# Altium schematic sheet 05_Power.SchDoc: Power
size A4; SheetNumber: 6; SheetTotal: 7; Project_Name: Monitoring_Control_Circuit; Designer: Hao Thai; Version: 1.0
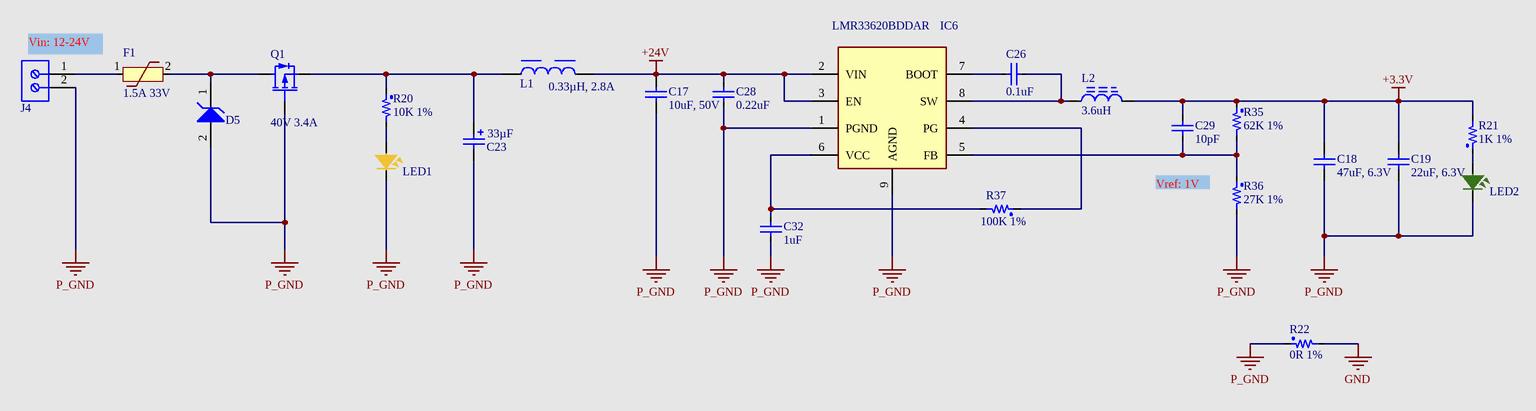
[diagram p0: 05_Power.SchDoc]

## Parts
C17  10uF, 50V  [WCAP-CSGP_1210_H=2.5mm]
C18  47uF, 6.3V  [WCAP-CSGP_1206_H=1.6mm]
C19  22uF, 6.3V  [WCAP-CSGP_1206_H=1.6mm]
C23  33µF  [WCAP-PSLP_D5H5.8]
C26  0.1uF  [C0603 (1608 metric)]
C28  0.22uF  [C0805 (2012 METRIC)]
C29  10pF  [C0603 (1608 metric)]
C32  1uF  [C0603 (1608 metric)]
D5  400W, 26VDC  [WE-TVSP_DO-214AC_Unidirectional]  (value not drawn)
F1  1.5A 33V  [FUSE_2902(7555 metric)]
IC6  LMR33620BDDAR  [SOIC127P600X170-9N]
J4  691103110002  [691103110002]  (value not drawn)
L1  0.33µH, 2.8A  [WE-TPC_2811]
L2  3.6uH  [SRN80408R2Y]
LED1  Yellow  [LED0603_YELLOW]  (value not drawn)
LED2  Green  [LED0603_GREEN]  (value not drawn)
Q1  40V 3.4A  [FET_SOT23-3]
R20  10K 1%  [R0603 (1608 Metric)]
R21  1K 1%  [R0603 (1608 Metric)]
R22  0R 1%  [R0603 (1608 Metric)]
R35  62K 1%  [R0603 (1608 Metric)]
R36  27K 1%  [R0603 (1608 Metric)]
R37  100K 1%  [R0603 (1608 Metric)]

## Nets
+3.3V: C18.2 C19.2 C29.2 L2.2 R21.2 R35.1
+24V: C17.2 C28.1 IC6.2(VIN) IC6.3(EN) L1.2
GND: R22.2
P_GND: C17.1 C18.1 C19.1 C23.2(N) C28.2 C32.1 D5.2(A) IC6.1(PGND) IC6.9(AGND) J4.2 LED1.2 LED2.2 Q1.1(G) R22.1 R36.2
NetC23_1: C23.1(P) L1.1 Q1.2(S) R20.1
NetC26_1: C26.1 IC6.7(BOOT)
NetC26_2: C26.2 IC6.8(SW) L2.1
NetC29_1: C29.1 IC6.5(FB) R35.2 R36.1
NetC32_2: C32.2 IC6.6(VCC) R37.2
NetD5_1: D5.1(K) F1.2 Q1.3(D)
NetF1_1: F1.1 J4.1
NetIC6_4: IC6.4(PG) R37.1
NetLED1_1: LED1.1 R20.2
NetLED2_1: LED2.1 R21.1

## Notes on the sheet
- Vin: 12-24V
- Vref: 1V
- Document Title:
- BK Maker Club
- Size:
- Project Name:
- A4
- Designer:
- Reviewer:
- Revision:
- Sheet
- of
- Nguyen Xien Street
- Long Thanh My Ward, Thu Duc District
- Ho Chi Minh City
- Date:
- File:

## Library data of the parts
C17 = 885012209073: WCAP-CSGP Multilayer Ceramic Chip Capacitor, General Purpose, size 1210, X7R, 10uF, 50V; Mfr: Wurth Elektronik; Rated Voltage: 50VDC; Isolation Resistance: >=0.01GOhm; Capacitance Tolerance: +/-10%; Technical Reference: X7R1210106K050DFCT10000; ComponentLink1Description: Manufacturer; ComponentLink1URL: http://www.we-online.de; ComponentLink2Description: Datasheet; ComponentLink2URL: https://www.we-online.com/catalog/datasheet/885012209073.pdf; Operating Temperature: -55 to +125degC; Packaging: Tape and Reel; Mfr Part Number: 885012209073; Published Date: May 2020; Ceramic Type: X7R; Dissipation Factor: =<10%; Height: 2.5mm; Mounting Technology: SMT; Size: 1210; Capacitance: 10uF
C18 = 885012108004: WCAP-CSGP Multilayer Ceramic Chip Capacitor, General Purpose, size 1206, X5R, 47uF, 6.3V; Mfr: Wurth Elektronik; Rated Voltage: 6.3VDC; Isolation Resistance: >=0.002GOhm; Capacitance Tolerance: +/-20%; Technical Reference: X5R1206476M6R3DFCT10000; ComponentLink1Description: Manufacturer; ComponentLink1URL: http://www.we-online.de; ComponentLink2Description: Datasheet; ComponentLink2URL: https://www.we-online.com/catalog/datasheet/885012108004.pdf; Operating Temperature: -55 to +85degC; Packaging: Tape and Reel; Mfr Part Number: 885012108004; Published Date: May 2020; Ceramic Type: X5R; Dissipation Factor: =<10%; Height: 1.6mm; Mounting Technology: SMT; Size: 1206; Capacitance: 47uF
C19 = 885012108003: WCAP-CSGP Multilayer Ceramic Chip Capacitor, General Purpose, size 1206, X5R, 22uF, 6.3V; Mfr: Wurth Elektronik; Rated Voltage: 6.3VDC; Isolation Resistance: >=0.002GOhm; Capacitance Tolerance: +/-20%; Technical Reference: X5R1206226M6R3DFCT10000; ComponentLink1Description: Manufacturer; ComponentLink1URL: http://www.we-online.de; ComponentLink2Description: Datasheet; ComponentLink2URL: https://www.we-online.com/catalog/datasheet/885012108003.pdf; Operating Temperature: -55 to +85degC; Packaging: Tape and Reel; Mfr Part Number: 885012108003; Published Date: May 2020; Ceramic Type: X5R; Dissipation Factor: =<10%; Height: 1.6mm; Mounting Technology: SMT; Size: 1206; Capacitance: 22uF
C23 = 875105359004: WCAP-PSLP Aluminum Polymer Capacitor, V-Chip SMT, D5 x H5.8mm, 33µF, 16V; Mfr: Wurth Elektronik; Capacitance Tolerance: +/-20%; Dissipation Factor: 8%; Endurance: 2000h; ESR: 30mΩ; Leakage Current: 400µA; Ripple Current: 2200mA; Technical Reference: PSEC058330M016DVCTBB000; ComponentLink1Description: Website Link; ComponentLink1URL: https://www.we-online.com/redexpert/article/875105359004?ad; ComponentLink2Description: Datasheet Link; ComponentLink2URL: https://www.we-online.com/redexpert/spec/875105359004?ad; Mfr Part Number: 875105359004; Category: Aluminum Polymer Capacitors; Match Code: WCAP-PSLP; Mount: Surface Mount; Operating Temperature Max: 105°C; Operating Temperature Min: -55°C; Packaging: Tape and Reel; Height: 5.8mm; Diameter: 5mm; Capacitance: 33µF; Rated Voltage (DC): 16V
C26 = CC0603KRX7R9BB104: Multilayer Ceramic Capacitors MLCC - SMD/SMT 0.1uF 50V X7R +/-10% 0603; Mfr: Yageo; Tolerance: 10%; Mfr Part Number: CC0603KRX7R9BB104; Supplier Part Number 1: 603-CC603KRX7R9BB104; Supplier 1: Mouser; Value: 0.1uF; Dielectric: X7R; Case: 0603 (1608 metric); Voltage: 50V
C28 = UMK212B7224KG-T: Multilayer Ceramic Capacitors MLCC - SMD/SMT 0805 50VDC 0.22uF 10% X7R; Mfr: Taiyo Yuden; Voltage: 50V; Mfr Part Number: UMK212B7224KG-T; Supplier Part Number 1: 963-UMK212B7224KG-T; Supplier 1: Mouser; Value: 0.22uF; Dielectric: X7R; Case: 0805 (2012 metric); Tolerance: 10%
C29 = CC0603JRNPO9BN100: Multilayer Ceramic Capacitors MLCC - SMD/SMT 10pF 250V C0G +/-5% 0603; Mfr: Yageo; Dielectric: C0G (NP0); Voltage: 50V; Tolerance: 5%; Mfr Part Number: CC0603JRNPO9BN100; Supplier Part Number 1: 603-CC603JRNPO9BN100; Supplier 1: Mouser; Value: 10pF; Case: 0603 (1608 metric)
C32 = CC0603KRX7R7BB105: Multilayer Ceramic Capacitors MLCC - SMD/SMT 1.0uF 16V X7R +/-10% 0603; Mfr: Yageo; Tolerance: 10%; Mfr Part Number: CC0603KRX7R7BB105; Supplier Part Number 1: 603-CC603KRX7R7BB105; Supplier 1: Mouser; Value: 1uF; Dielectric: X7R; Case: 0603 (1608 metric); Voltage: 16V
D5 = 824500261: WE-TVSP SMT Power TVS Diode, DO-214AC, Unidirectional, 400W, 26VDC; Mfr: Wurth Elektronik; Clamping Voltage: 42.1V; Operating Voltage (DC): 26V; (Reverse) Breakdown Voltage: 30.4V; (Reverse) Peak Pulse Current: 9.5A; ComponentLink1Description: Website Link; ComponentLink1URL: https://www.we-online.com/redexpert/article/824500261?ad; ComponentLink2Description: Datasheet Link; ComponentLink2URL: https://www.we-online.com/redexpert/spec/824500261?ad; Mfr Part Number: 824500261; Category: Surge Protection; Match Code: WE-TVSP; Mount: Surface Mount; Operating Temperature Max: 150°C; Operating Temperature Min: -65°C; Packaging: Tape and Reel; Case/Size Code: DO-214AC; Length: 4.24mm; Width: 2.67mm; Height: 2.25mm; Polarity: Unidirectional; Power Dissipation: 400W
F1 = 0ZCF0150FF2C: Resettable Fuses - PPTC Fuse; Mfr: Bel Fuse; Hold Current: 1.5; Trip Current: 3A; Supplier 1: Mouser; Mfr Part Number: 0ZCF0150FF2C; Supplier Part Number 1: 530-0ZCF0150FF2C; Value: 1.5A 33V; Maximum Voltage: 33V; Package: 2920 (7555 metric)
IC6 = LMR33620BDDAR: Buck Switching Regulator IC Positive Adjustable 1V 1 Output 2A 8-PowerSOIC (0.154", 3.90mm Width); Mfr: Texas Instruments; Datasheet Link: http://www.ti.com/lit/gpn/lmr33620; Height: 1.7mm; Mfr Part Number: LMR33620BDDAR; Supplier Part Number 1: 595-LMR33620BDDAR; Supplier 1: Mouser; Arrow Part Number: LMR33620BDDAR; Arrow Price/Stock: https://www.arrow.com/en/products/lmr33620bddar/texas-instruments
J4 = 691103110002: WR-TBL Series 1031 Horizontal Entry Modular, THT, pitch 3.5mm, 2p; Mfr: Wurth Elektronik; Modularity: Yes; Rated Current: 10A; Working Voltage: 125V; ComponentLink1Description: Website Link; ComponentLink1URL: https://www.we-online.com/redexpert/article/691103110002?ad; ComponentLink2Description: Datasheet Link; ComponentLink2URL: https://www.we-online.com/redexpert/spec/691103110002?ad; Mfr Part Number: 691103110002; Category: Terminal Blocks; Match Code: WR-TBL; Mount: Through Hole; Operating Temperature Max: 105°C; Operating Temperature Min: -40°C; Packaging: Box; Application: Pressure Clamp; Number of Pins: 2; Number of Rows: 1; Orientation: Horizontal; Pitch: 3.5mm
L1 = 74402800033: WE-TPC SMT Tiny Power Inductor, 2811, 0.33µH, 2.8A, 35mΩ; Mfr: Wurth Elektronik; Case/Size Code: 2811; DC Resistance: 27mΩ; Saturation Current: 2.4A; Self Resonant Frequency: 550MHz; ComponentLink1Description: Website Link; ComponentLink1URL: https://www.we-online.com/redexpert/article/74402800033?ad; ComponentLink2Description: Datasheet Link; ComponentLink2URL: https://www.we-online.com/redexpert/spec/74402800033?ad; Mfr Part Number: 74402800033; Category: Shielded Power Inductors; Match Code: WE-TPC; Mount: Surface Mount; Operating Temperature Max: 125°C; Operating Temperature Min: -40°C; Packaging: Tape and Reel; Length: 2.78mm; Width: 2.78mm; Height: 1.1mm; DC Resistance Max: 35mΩ; Inductance: 0.33µH; Rated Current: 2.8A
L2 = SRN8040-3R6Y: Fixed Inductors 3.6uH 30% SMD 8040; Mfr: Bourns; Maximum DC Current: 4.9 A; Maximum DC Resistance: 22 mOhms; Value: 3.6uH; Mfr Part Number: SRN8040-3R6Y; Supplier 1: Mouser; Supplier Part Number 1: 652-SRN8040-3R6Y; Package: 8 mm x 8 mm
LED1 = LTST-C190YKT: Standard LEDs - SMD 0603 Yellow Clear 588nm; Mfr: Lite-On; Vf - Forward Voltage: 2.1 V; If - Forward Current: 20mA; Illumination Color: Yellow 588 nm; Supplier 1: Mouser; Mfr Part Number: LTST-C190YKT; Supplier Part Number 1: 859-LTST-C190YKT; Package: 0603 (1608 metric)
LED2 = LTST-C191GKT: Standard LEDs - SMD 0603 Green Clear 569nm; Mfr: Lite-On; Vf - Forward Voltage: 2.1 V; If - Forward Current: 20mA; Illumination Color: Green 569 nm; Supplier 1: Mouser; Mfr Part Number: LTST-C191GKT; Supplier Part Number 1: 859-LTST-C191GKT; Package: 0603 (1608 metric)
Q1 = DMP4065SQ-13: MOSFET MOSFET BVDSS: 31V-40V; Mfr: Diodes Incorporated; Gate-to-Source Voltage: +/-25V; Mfr Part Number: DMP4065SQ-13; Supplier Part Number 1: 621-DMP4065SQ-13; Supplier 1: Mouser; Value: 40V 3.4A
R20 = RC0603FR-0710KL: Thick Film Resistors - SMD 10K OHM 1% Case 0603; Mfr: Yageo; Value: 10K; Supplier 1: Mouser; Supplier Part Number 1: 603-RC0603FR-0710KL; Mfr Part Number: RC0603FR-0710KL; Case: 0603 (1608 metric); Tolerance: 1%
R21 = RC0603FR-071KL: Thick Film Resistors - SMD 1K OHM 1% Case 0603; Mfr: Yageo; Value: 1K; Supplier 1: Mouser; Supplier Part Number 1: 603-RC0603FR-071KL; Mfr Part Number: RC0603FR-071KL; Case: 0603 (1608 metric); Tolerance: 1%
R22 = RC0603FR-070RL: Thick Film Resistors - SMD 0 OHM 1% Case 0603; Mfr: Yageo; Value: 0R; Supplier 1: Mouser; Supplier Part Number 1: 603-RC0603FR-070RL; Mfr Part Number: RC0603FR-070RL; Case: 0603 (1608 metric); Tolerance: 1%
R35 = RC0603FR-0762KL: Thick Film Resistors - SMD 62 kOhms 100mW 0603 1%; Mfr: Yageo; Value: 62K; Supplier 1: Mouser; Supplier Part Number 1: 603-RC0603FR-072K2L; Mfr Part Number: RC0603FR-0762KL; Case: 0603 (1608 metric); Tolerance: 1%
R36 = RC0603FR-0727KL: Thick Film Resistors - SMD 27K OHM 1% Case 0603; Mfr: Yageo; Value: 27K; Supplier 1: Mouser; Supplier Part Number 1: 603-RC0603FR-0727KL; Mfr Part Number: RC0603FR-0727KL; Case: 0603 (1608 metric); Tolerance: 1%
R37 = RC0603FR-07100KL: Thick Film Resistors - SMD 100K OHM 1% Case 0603; Mfr: Yageo; Value: 100K; Supplier 1: Mouser; Supplier Part Number 1: 603-RC0603FR-07100KL; Mfr Part Number: RC0603FR-07100KL; Case: 0603 (1608 metric); Tolerance: 1%